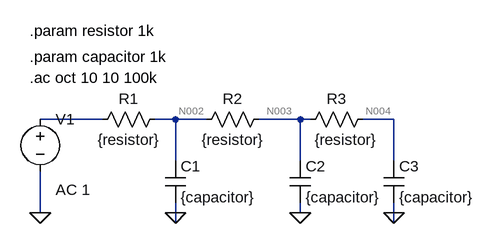
[diagram p0: schematic Draft3.asc]
Draft3.asc, the LTspice schematic file:
Version 4
SHEET 1 880 680
WIRE 64 144 -32 144
WIRE 176 144 144 144
WIRE 224 144 176 144
WIRE 368 144 304 144
WIRE 384 144 368 144
WIRE 512 144 464 144
WIRE 176 208 176 144
WIRE 368 208 368 144
WIRE 512 208 512 144
WIRE -32 288 -32 224
WIRE 176 288 176 272
WIRE 368 288 368 272
WIRE 512 288 512 272
WIRE 176 304 176 288
WIRE 512 304 512 288
FLAG 176 288 0
FLAG 368 288 0
FLAG 512 288 0
FLAG -32 288 0
SYMBOL voltage -32 128 R0
WINDOW 123 24 124 Left 2
WINDOW 39 0 0 Left 0
SYMATTR InstName V1
SYMATTR Value ""
SYMATTR Value2 AC 1
SYMBOL res 160 128 R90
WINDOW 0 0 56 VBottom 2
WINDOW 3 32 56 VTop 2
SYMATTR InstName R1
SYMATTR Value {resistor}
SYMBOL res 320 128 R90
WINDOW 0 0 56 VBottom 2
WINDOW 3 32 56 VTop 2
SYMATTR InstName R2
SYMATTR Value {resistor}
SYMBOL res 480 128 R90
WINDOW 0 0 56 VBottom 2
WINDOW 3 32 42 VTop 2
SYMATTR InstName R3
SYMATTR Value {resistor}
SYMBOL cap 160 208 R0
SYMATTR InstName C1
SYMATTR Value {capacitor}
SYMBOL cap 352 208 R0
SYMATTR InstName C2
SYMATTR Value {capacitor}
SYMBOL cap 496 208 R0
SYMATTR InstName C3
SYMATTR Value {capacitor}
TEXT -48 8 Left 2 !.param resistor 1k
TEXT -48 48 Left 2 !.param capacitor 1k
TEXT -48 80 Left 2 !.ac oct 10 10 100k

The netlist it stands for:
* Draft3.asc
V1 N001 0 AC 1
R1 N002 N001 {resistor}
R2 N003 N002 {resistor}
R3 N004 N003 {resistor}
C1 N002 0 {capacitor}
C2 N003 0 {capacitor}
C3 N004 0 {capacitor}
.param resistor 1k
.param capacitor 1k
.ac oct 10 10 100k
.backanno
.end

* Results of the author's LTspice run, read from the files saved beside the schematic
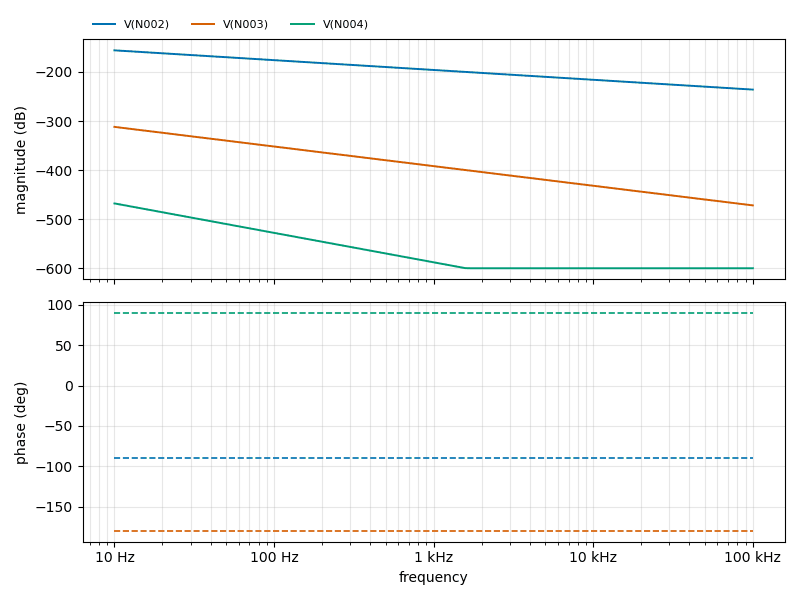
[diagram p1: AC Analysis of Draft3.asc, plotted from the saved traces]
* AC Analysis, 1 run:
*   V(N002): -155.96 dB at 10 Hz, -235.96 dB at 100 kHz, peak -155.96 dB at 10 Hz, 3 dB below the peak at 14.14 Hz
*   V(N003): -311.93 dB at 10 Hz, -471.93 dB at 100 kHz, peak -311.93 dB at 10 Hz, 3 dB below the peak at 11.89 Hz
*   V(N004): -467.89 dB at 10 Hz, -600.00 dB at 100 kHz, peak -467.89 dB at 10 Hz, 3 dB below the peak at 11.22 Hz